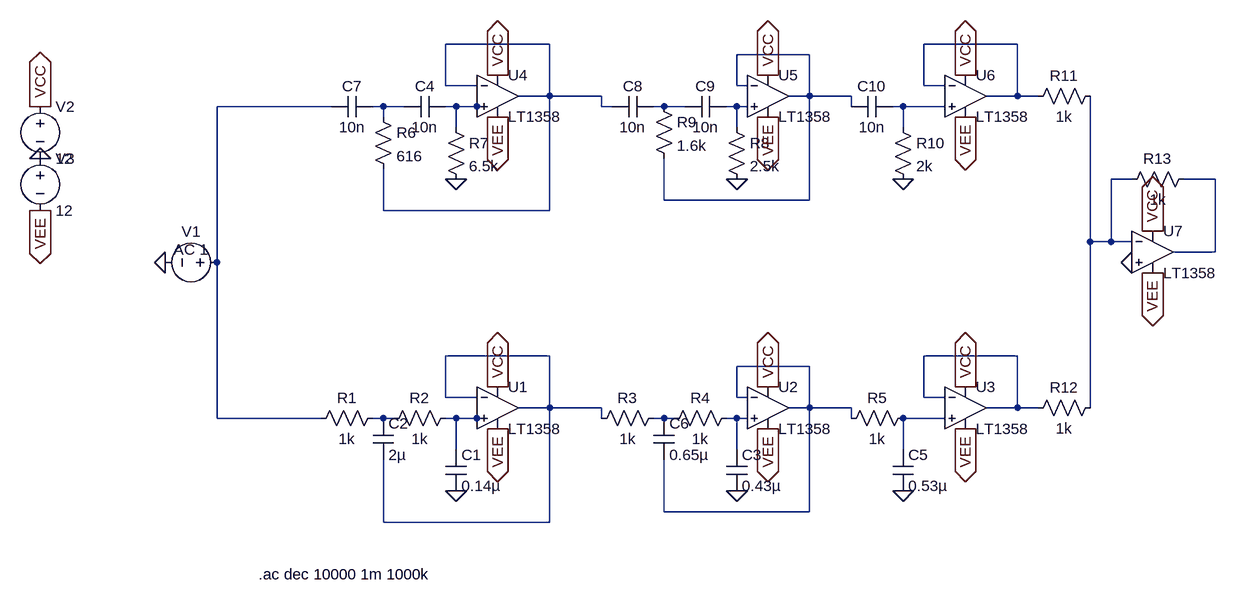
[diagram p0: schematic Stop_Band_FIlter.asc]
Stop_Band_FIlter.asc, the LTspice schematic file:
Version 4
SHEET 1 1292 680
WIRE 256 -400 96 -400
WIRE 976 -400 832 -400
WIRE 656 -384 544 -384
WIRE 96 -336 96 -400
WIRE 144 -336 96 -336
WIRE 544 -336 544 -384
WIRE 560 -336 544 -336
WIRE 832 -336 832 -400
WIRE 864 -336 832 -336
WIRE 256 -320 256 -400
WIRE 256 -320 208 -320
WIRE 336 -320 256 -320
WIRE 656 -320 656 -384
WIRE 656 -320 624 -320
WIRE 720 -320 656 -320
WIRE 976 -320 976 -400
WIRE 976 -320 928 -320
WIRE 1008 -320 976 -320
WIRE -80 -304 -256 -304
WIRE 0 -304 -16 -304
WIRE 32 -304 0 -304
WIRE 112 -304 96 -304
WIRE 144 -304 112 -304
WIRE 160 -304 144 -304
WIRE 336 -304 336 -320
WIRE 352 -304 336 -304
WIRE 432 -304 416 -304
WIRE 464 -304 432 -304
WIRE 544 -304 528 -304
WIRE 560 -304 544 -304
WIRE 720 -304 720 -320
WIRE 800 -304 784 -304
WIRE 864 -304 800 -304
WIRE 0 -288 0 -304
WIRE 112 -272 112 -304
WIRE 544 -272 544 -304
WIRE 800 -272 800 -304
WIRE 1152 -192 1120 -192
WIRE 1280 -192 1232 -192
WIRE 432 -160 432 -224
WIRE 656 -160 656 -320
WIRE 656 -160 432 -160
WIRE 0 -144 0 -208
WIRE 256 -144 256 -320
WIRE 256 -144 0 -144
WIRE 1088 -96 1088 -320
WIRE 1120 -96 1120 -192
WIRE 1120 -96 1088 -96
WIRE 1152 -96 1120 -96
WIRE 1280 -80 1280 -192
WIRE 1280 -80 1216 -80
WIRE -256 -64 -256 -304
WIRE 256 80 96 80
WIRE 976 80 832 80
WIRE 656 96 544 96
WIRE 96 144 96 80
WIRE 144 144 96 144
WIRE 544 144 544 96
WIRE 560 144 544 144
WIRE 832 144 832 80
WIRE 864 144 832 144
WIRE 256 160 256 80
WIRE 256 160 208 160
WIRE 336 160 256 160
WIRE 656 160 656 96
WIRE 656 160 624 160
WIRE 720 160 656 160
WIRE 976 160 976 80
WIRE 976 160 928 160
WIRE 1008 160 976 160
WIRE 1088 160 1088 -96
WIRE -256 176 -256 -64
WIRE -96 176 -256 176
WIRE 0 176 -16 176
WIRE 16 176 0 176
WIRE 112 176 96 176
WIRE 144 176 112 176
WIRE 160 176 144 176
WIRE 336 176 336 160
WIRE 432 176 416 176
WIRE 448 176 432 176
WIRE 544 176 528 176
WIRE 560 176 544 176
WIRE 720 176 720 160
WIRE 864 176 800 176
WIRE 112 224 112 176
WIRE 544 224 544 176
WIRE 800 224 800 176
WIRE 432 320 432 240
WIRE 656 320 656 160
WIRE 656 320 432 320
WIRE 0 336 0 240
WIRE 256 336 256 160
WIRE 256 336 0 336
FLAG 112 288 0
FLAG 544 288 0
FLAG 800 288 0
FLAG -528 -224 0
FLAG -528 -304 VCC
IOPIN -528 -304 Out
FLAG -528 -144 VEE
IOPIN -528 -144 Out
FLAG 176 128 VCC
IOPIN 176 128 Out
FLAG 592 128 VCC
IOPIN 592 128 Out
FLAG 896 128 VCC
IOPIN 896 128 Out
FLAG 176 192 VEE
IOPIN 176 192 Out
FLAG 592 192 VEE
IOPIN 592 192 Out
FLAG 896 192 VEE
IOPIN 896 192 Out
FLAG 112 -192 0
FLAG 544 -192 0
FLAG 800 -192 0
FLAG 176 -352 VCC
IOPIN 176 -352 Out
FLAG 592 -352 VCC
IOPIN 592 -352 Out
FLAG 896 -352 VCC
IOPIN 896 -352 Out
FLAG 176 -288 VEE
IOPIN 176 -288 Out
FLAG 592 -288 VEE
IOPIN 592 -288 Out
FLAG 896 -288 VEE
IOPIN 896 -288 Out
FLAG -336 -64 0
FLAG 1184 -112 VCC
IOPIN 1184 -112 Out
FLAG 1184 -48 VEE
IOPIN 1184 -48 Out
FLAG 1152 -64 0
SYMBOL Opamps\\LT1358 176 96 R0
SYMATTR InstName U1
SYMBOL Opamps\\LT1358 592 96 R0
SYMATTR InstName U2
SYMBOL Opamps\\LT1358 896 96 R0
SYMATTR InstName U3
SYMBOL res 0 160 R90
WINDOW 0 0 56 VBottom 2
WINDOW 3 32 56 VTop 2
SYMATTR InstName R1
SYMATTR Value 1k
SYMBOL res 112 160 R90
WINDOW 0 0 56 VBottom 2
WINDOW 3 32 56 VTop 2
SYMATTR InstName R2
SYMATTR Value 1k
SYMBOL cap 96 224 R0
SYMATTR InstName C1
SYMATTR Value 0.14µ
SYMBOL res 432 160 R90
WINDOW 0 0 56 VBottom 2
WINDOW 3 32 56 VTop 2
SYMATTR InstName R3
SYMATTR Value 1k
SYMBOL res 544 160 R90
WINDOW 0 0 56 VBottom 2
WINDOW 3 32 56 VTop 2
SYMATTR InstName R4
SYMATTR Value 1k
SYMBOL cap 528 224 R0
SYMATTR InstName C3
SYMATTR Value 0.43µ
SYMBOL res 816 160 R90
WINDOW 0 0 56 VBottom 2
WINDOW 3 32 56 VTop 2
SYMATTR InstName R5
SYMATTR Value 1k
SYMBOL cap 784 224 R0
SYMATTR InstName C5
SYMATTR Value 0.53µ
SYMBOL cap -16 176 R0
SYMATTR InstName C2
SYMATTR Value 2µ
SYMBOL cap 416 176 R0
SYMATTR InstName C6
SYMATTR Value 0.65µ
SYMBOL voltage -528 -320 R0
WINDOW 123 0 0 Left 0
WINDOW 39 0 0 Left 0
SYMATTR InstName V2
SYMATTR Value 12
SYMBOL voltage -528 -240 R0
WINDOW 123 0 0 Left 0
WINDOW 39 0 0 Left 0
SYMATTR InstName V3
SYMATTR Value 12
SYMBOL Opamps\\LT1358 176 -384 R0
SYMATTR InstName U4
SYMBOL Opamps\\LT1358 592 -384 R0
SYMATTR InstName U5
SYMBOL Opamps\\LT1358 896 -384 R0
SYMATTR InstName U6
SYMBOL cap 96 -320 R90
WINDOW 0 0 32 VBottom 2
WINDOW 3 32 32 VTop 2
SYMATTR InstName C4
SYMATTR Value 10n
SYMBOL cap -16 -320 R90
WINDOW 0 0 32 VBottom 2
WINDOW 3 32 32 VTop 2
SYMATTR InstName C7
SYMATTR Value 10n
SYMBOL res -16 -304 R0
SYMATTR InstName R6
SYMATTR Value 616
SYMBOL res 96 -288 R0
SYMATTR InstName R7
SYMATTR Value 6.5k
SYMBOL cap 416 -320 R90
WINDOW 0 0 32 VBottom 2
WINDOW 3 32 32 VTop 2
SYMATTR InstName C8
SYMATTR Value 10n
SYMBOL cap 528 -320 R90
WINDOW 0 0 32 VBottom 2
WINDOW 3 32 32 VTop 2
SYMATTR InstName C9
SYMATTR Value 10n
SYMBOL res 528 -288 R0
SYMATTR InstName R8
SYMATTR Value 2.5k
SYMBOL res 416 -320 R0
SYMATTR InstName R9
SYMATTR Value 1.6k
SYMBOL cap 784 -320 R90
WINDOW 0 0 32 VBottom 2
WINDOW 3 32 32 VTop 2
SYMATTR InstName C10
SYMATTR Value 10n
SYMBOL res 784 -288 R0
SYMATTR InstName R10
SYMATTR Value 2k
SYMBOL voltage -240 -64 R90
WINDOW 0 -32 56 VBottom 2
WINDOW 3 32 56 VTop 2
WINDOW 123 -4 56 VBottom 2
WINDOW 39 0 0 Left 0
SYMATTR InstName V1
SYMATTR Value ""
SYMATTR Value2 AC 1
SYMBOL Opamps\\LT1358 1184 -144 R0
SYMATTR InstName U7
SYMBOL res 1104 -336 R90
WINDOW 0 0 56 VBottom 2
WINDOW 3 32 56 VTop 2
SYMATTR InstName R11
SYMATTR Value 1k
SYMBOL res 1104 144 R90
WINDOW 0 0 56 VBottom 2
WINDOW 3 32 56 VTop 2
SYMATTR InstName R12
SYMATTR Value 1k
SYMBOL res 1248 -208 R90
WINDOW 0 0 56 VBottom 2
WINDOW 3 32 56 VTop 2
SYMATTR InstName R13
SYMATTR Value 1k
TEXT -192 416 Left 2 !.ac dec 10000 1m 1000k

The netlist it stands for:
* Stop_Band_FIlter.asc
XU1 N016 N012 VCC VEE N012 LT1357  ; LT1358, pins In+ In- V+ V- OUT
XU2 N018 N014 VCC VEE N014 LT1357  ; LT1358, pins In+ In- V+ V- OUT
XU3 N019 N013 VCC VEE N013 LT1357  ; LT1358, pins In+ In- V+ V- OUT
R1 N015 N004 1k
R2 N016 N015 1k
C1 N016 0 0.14µ
R3 N017 N012 1k
R4 N018 N017 1k
C3 N018 0 0.43µ
R5 N019 N014 1k
C5 N019 0 0.53µ
C2 N015 N012 2µ
C6 N017 N014 0.65µ
V2 VCC 0 12
V3 0 VEE 12
XU4 N006 N001 VCC VEE N001 LT1357  ; LT1358, pins In+ In- V+ V- OUT
XU5 N008 N003 VCC VEE N003 LT1357  ; LT1358, pins In+ In- V+ V- OUT
XU6 N009 N002 VCC VEE N002 LT1357  ; LT1358, pins In+ In- V+ V- OUT
C4 N006 N005 10n
C7 N005 N004 10n
R6 N005 N001 616
R7 N006 0 6.5k
C8 N007 N001 10n
C9 N008 N007 10n
R8 N008 0 2.5k
R9 N007 N003 1.6k
C10 N009 N003 10n
R10 N009 0 2k
V1 N004 0 AC 1
XU7 0 N010 VCC VEE N011 LT1357  ; LT1358, pins In+ In- V+ V- OUT
R11 N010 N002 1k
R12 N010 N013 1k
R13 N011 N010 1k
.ac dec 10000 1m 1000k
.lib LTC.lib
.backanno
.end